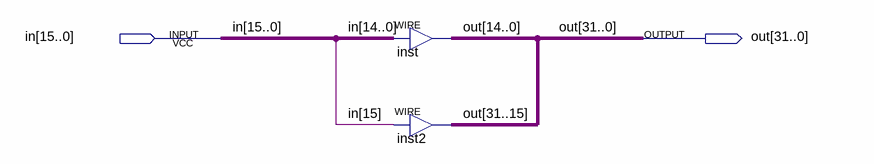
[diagram p0: schematic sheet]
// Quartus schematic SignExtent.bdf as structural Verilog: 2 symbols, 2 pins
module SignExtent (
  input  [15:0] in,
  output [31:0] out
);

  assign out[14:0] = in[14:0];  // WIRE inst
  assign out[31:15] = {17{in[15]}};  // WIRE inst2
endmodule
